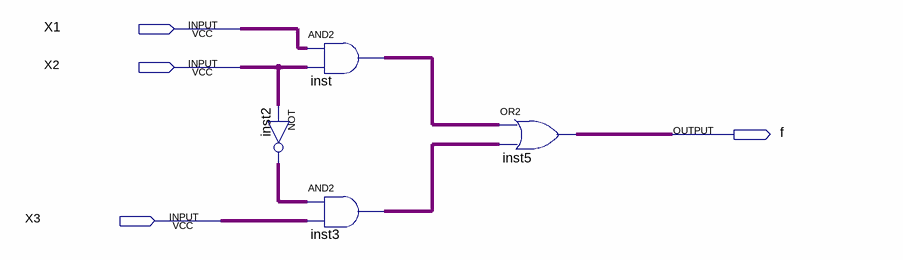
[diagram p0: schematic sheet]
// Quartus schematic Tutorial_QuartusII_Schematic.bdf as structural Verilog: 4 symbols, 4 pins
module Tutorial_QuartusII_Schematic (
  input  X1,
  input  X2,
  input  X3,
  output f
);

  wire inst2_out, inst3_out, inst_out;

  not inst2 (inst2_out, X2);
  and inst (inst_out, X1, X2);
  and inst3 (inst3_out, inst2_out, X3);
  or inst5 (f, inst_out, inst3_out);
endmodule
